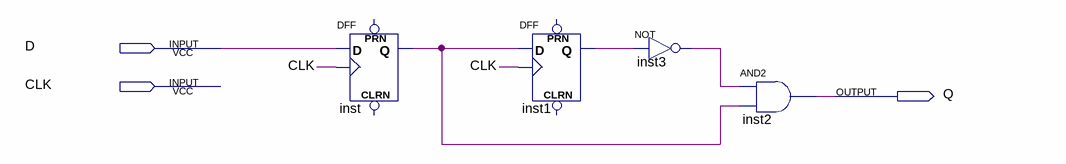
[diagram p0: schematic sheet]
// Quartus schematic RisingEdge.bdf as structural Verilog: 4 symbols, 3 pins
module RisingEdge (
  input  D,
  input  CLK,
  output Q
);

  wire inst1_q, inst3_out, inst_q;

  DFF inst (.CLK(CLK), .D(D), .Q(inst_q));  // open: CLRN, PRN
  DFF inst1 (.CLK(CLK), .D(inst_q), .Q(inst1_q));  // open: CLRN, PRN
  not inst3 (inst3_out, inst1_q);
  and inst2 (Q, inst3_out, inst_q);
endmodule
